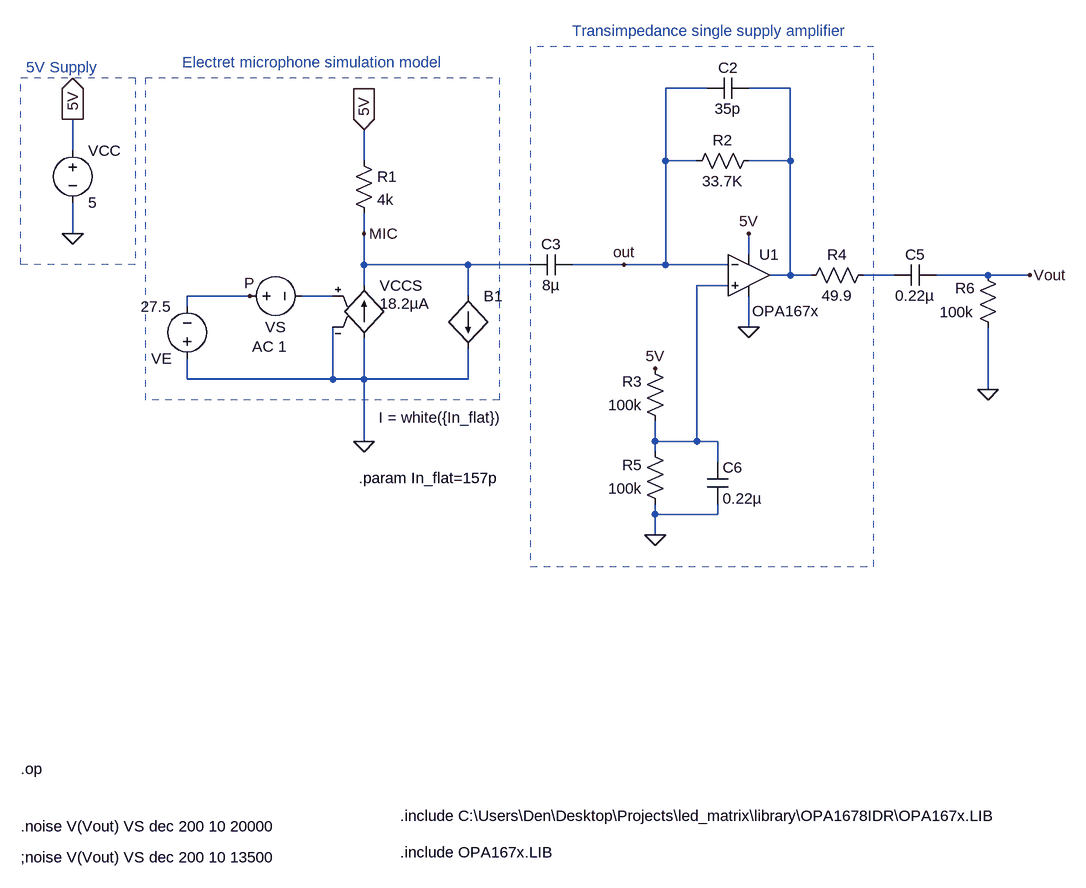
[diagram p0: schematic Draft1.asc]
Draft1.asc, the LTspice schematic file:
Version 4
SHEET 1 1656 680
WIRE 752 -704 688 -704
WIRE 880 -704 816 -704
WIRE -224 -608 -224 -656
WIRE 224 -592 224 -640
WIRE 688 -592 688 -704
WIRE 736 -592 688 -592
WIRE 880 -592 880 -704
WIRE 880 -592 816 -592
WIRE -224 -480 -224 -528
WIRE 224 -480 224 -512
WIRE 816 -448 816 -480
WIRE 224 -432 224 -480
WIRE 384 -432 224 -432
WIRE 480 -432 384 -432
WIRE 624 -432 544 -432
WIRE 688 -432 688 -592
WIRE 688 -432 624 -432
WIRE 784 -432 688 -432
WIRE 880 -416 880 -592
WIRE 880 -416 848 -416
WIRE 912 -416 880 -416
WIRE 1040 -416 992 -416
WIRE 1184 -416 1104 -416
WIRE 1248 -416 1184 -416
WIRE 224 -400 224 -432
WIRE 784 -400 736 -400
WIRE 48 -384 -48 -384
WIRE 176 -384 128 -384
WIRE 384 -384 384 -432
WIRE -48 -368 -48 -384
WIRE 816 -336 816 -384
WIRE -48 -256 -48 -288
WIRE 176 -256 176 -336
WIRE 176 -256 -48 -256
WIRE 224 -256 224 -320
WIRE 224 -256 176 -256
WIRE 384 -256 384 -304
WIRE 384 -256 224 -256
WIRE 1184 -240 1184 -336
WIRE 224 -160 224 -256
WIRE 672 -160 672 -192
WIRE 736 -160 736 -400
WIRE 736 -160 672 -160
WIRE 768 -160 736 -160
WIRE 672 -144 672 -160
WIRE 768 -128 768 -160
WIRE 672 -48 672 -64
WIRE 768 -48 768 -64
WIRE 768 -48 672 -48
WIRE 672 -16 672 -48
FLAG -224 -656 5V
IOPIN -224 -656 Out
FLAG -224 -480 0
FLAG 224 -160 0
FLAG 48 -384 P
FLAG 224 -480 MIC
FLAG 224 -640 5V
IOPIN 224 -640 In
FLAG 624 -432 out
FLAG 816 -480 5V
FLAG 816 -336 0
FLAG 1184 -240 0
FLAG 672 -16 0
FLAG 672 -272 5V
FLAG 1248 -416 Vout
SYMBOL voltage 32 -384 R270
WINDOW 0 -32 56 VBottom 2
WINDOW 3 32 56 VTop 2
WINDOW 123 -62 47 VBottom 2
WINDOW 39 0 0 Left 0
SYMATTR InstName VS
SYMATTR Value ""
SYMATTR Value2 AC 1
SYMBOL g 224 -416 R0
WINDOW 3 24 44 Left 2
SYMATTR InstName VCCS
SYMATTR Value 18.2µA
SYMBOL voltage -224 -624 R0
WINDOW 123 0 0 Left 0
WINDOW 39 0 0 Left 0
SYMATTR InstName VCC
SYMATTR Value 5
SYMBOL voltage -48 -272 R180
WINDOW 123 0 0 Left 0
WINDOW 39 0 0 Left 0
SYMATTR InstName VE
SYMATTR Value 27.5
SYMBOL res 208 -608 R0
SYMATTR InstName R1
SYMATTR Value 4k
SYMBOL cap 544 -448 R90
WINDOW 0 0 32 VBottom 2
WINDOW 3 32 32 VTop 2
SYMATTR InstName C3
SYMATTR Value 8µ
SYMBOL bi 384 -384 R0
WINDOW 3 -137 187 Left 2
SYMATTR InstName B1
SYMATTR Value I = white({In_flat})
SYMBOL OpAmps\\opamp2 816 -480 R0
WINDOW 3 5 119 Left 2
SYMATTR InstName U1
SYMATTR Value OPA167x
SYMBOL res 832 -608 R90
WINDOW 0 0 56 VBottom 2
WINDOW 3 32 56 VTop 2
SYMATTR InstName R2
SYMATTR Value 33.7K
SYMBOL res 1008 -432 R90
WINDOW 0 0 56 VBottom 2
WINDOW 3 32 56 VTop 2
SYMATTR InstName R4
SYMATTR Value 49.9
SYMBOL res 1200 -320 R180
WINDOW 0 36 76 Left 2
WINDOW 3 38 39 Left 2
SYMATTR InstName R6
SYMATTR Value 100k
SYMBOL res 688 -176 R180
WINDOW 0 36 76 Left 2
WINDOW 3 36 40 Left 2
SYMATTR InstName R3
SYMATTR Value 100k
SYMBOL res 688 -48 R180
WINDOW 0 36 76 Left 2
WINDOW 3 36 40 Left 2
SYMATTR InstName R5
SYMATTR Value 100k
SYMBOL cap 752 -128 R0
SYMATTR InstName C6
SYMATTR Value 0.22µ
SYMBOL cap 1104 -432 R90
WINDOW 0 0 32 VBottom 2
WINDOW 3 32 32 VTop 2
SYMATTR InstName C5
SYMATTR Value 0.22µ
SYMBOL cap 816 -720 R90
WINDOW 0 0 32 VBottom 2
WINDOW 3 32 32 VTop 2
SYMATTR InstName C2
SYMATTR Value 35p
TEXT 280 416 Left 2 !.include C:\\Users\\Den\\Desktop\\Projects\\led_matrix\\library\\OPA1678IDR\\OPA167x.LIB
TEXT 280 472 Left 2 !.include OPA167x.LIB
TEXT -304 344 Left 2 !.op
TEXT 216 -104 Left 2 !.param In_flat=157p
TEXT -304 432 Left 2 !.noise V(Vout) VS dec 200 10 20000
TEXT -304 480 Left 2 !;noise V(Vout) VS dec 200 10 13500
TEXT -56 -744 Left 2 ;Electret microphone simulation model
TEXT 544 -792 Left 2 ;Transimpedance single supply amplifier
TEXT -296 -736 Left 2 ;5V Supply
LINE Normal -112 -224 -112 -720 2
LINE Normal 432 -224 -112 -224 2
LINE Normal 432 -720 432 -224 2
LINE Normal -112 -720 432 -720 2
LINE Normal 1008 -768 480 -768 2
LINE Normal 1008 32 1008 -768 2
LINE Normal 480 32 1008 32 2
LINE Normal 480 -768 480 32 2
RECTANGLE Normal -128 -432 -304 -720 2

The netlist it stands for:
* Draft1.asc
VS P N004 AC 1
G§VCCS 0 MIC N004 0 18.2µA
VCC 5V 0 5
VE 0 P 27.5
R1 5V MIC 4k
C3 out MIC 8µ
B1 MIC 0 I = white({In_flat})
XU1 N003 out 5V 0 N001 OPA167x  ; pins In+ In- V+ V- OUT
R2 N001 out 33.7K
R4 N002 N001 49.9
R6 0 Vout 100k
R3 N003 5V 100k
R5 0 N003 100k
C6 N003 0 0.22µ
C5 Vout N002 0.22µ
C2 N001 out 35p
.include C:\Users\Den\Desktop\Projects\led_matrix\library\OPA1678IDR\OPA167x.LIB
.include OPA167x.LIB
.op
.param In_flat=157p
.noise V(Vout) VS dec 200 10 20000
;noise V(Vout) VS dec 200 10 13500
* Electret microphone simulation model
* Transimpedance single supply amplifier
* 5V Supply
.backanno
.end